# Altium schematic sheet STM32-DHT11-LCD-Schematic.SchDoc
size A4
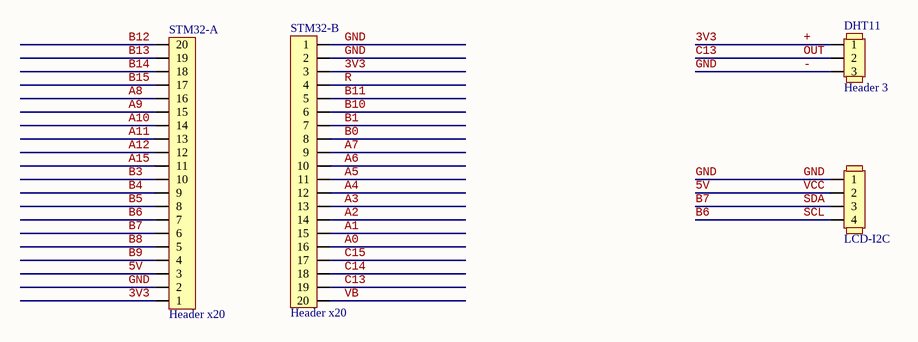
[diagram p0: STM32-DHT11-LCD-Schematic.SchDoc]

## Parts
DHT11  Header 3  [HEADER x3]
LCD-I2C  Header 4  [HEADER x4]  (value not drawn)
STM32-A  Header x20  [HEADER X20]
STM32-B  Header x20  [HEADER X20]

## Nets
5V: LCD-I2C.2 STM32-A.3  [also labelled VCC]
+: DHT11.1 STM32-A.1 STM32-B.3  [also labelled 3V3]
-: DHT11.3 LCD-I2C.1 STM32-A.2 STM32-B.1 STM32-B.2  [also labelled GND]
A0: STM32-B.16
A1: STM32-B.15
A2: STM32-B.14
A3: STM32-B.13
A4: STM32-B.12
A5: STM32-B.11
A6: STM32-B.10
A7: STM32-B.9
A8: STM32-A.16
A9: STM32-A.15
A10: STM32-A.14
A11: STM32-A.13
A12: STM32-A.12
A15: STM32-A.11
B0: STM32-B.8
B1: STM32-B.7
B3: STM32-A.10
B4: STM32-A.9
B5: STM32-A.8
B6: LCD-I2C.4 STM32-A.7  [also labelled SCL]
B7: LCD-I2C.3 STM32-A.6  [also labelled SDA]
B8: STM32-A.5
B9: STM32-A.4
B10: STM32-B.6
B11: STM32-B.5
B12: STM32-A.20
B13: STM32-A.19
B14: STM32-A.18
B15: STM32-A.17
C13: DHT11.2 STM32-B.19  [also labelled OUT]
C14: STM32-B.18
C15: STM32-B.17
R: STM32-B.4
VB: STM32-B.20